# Altium schematic sheet Sheet2.SchDoc
size 594 x 420 mm; SheetNumber: 1; SheetTotal: 1
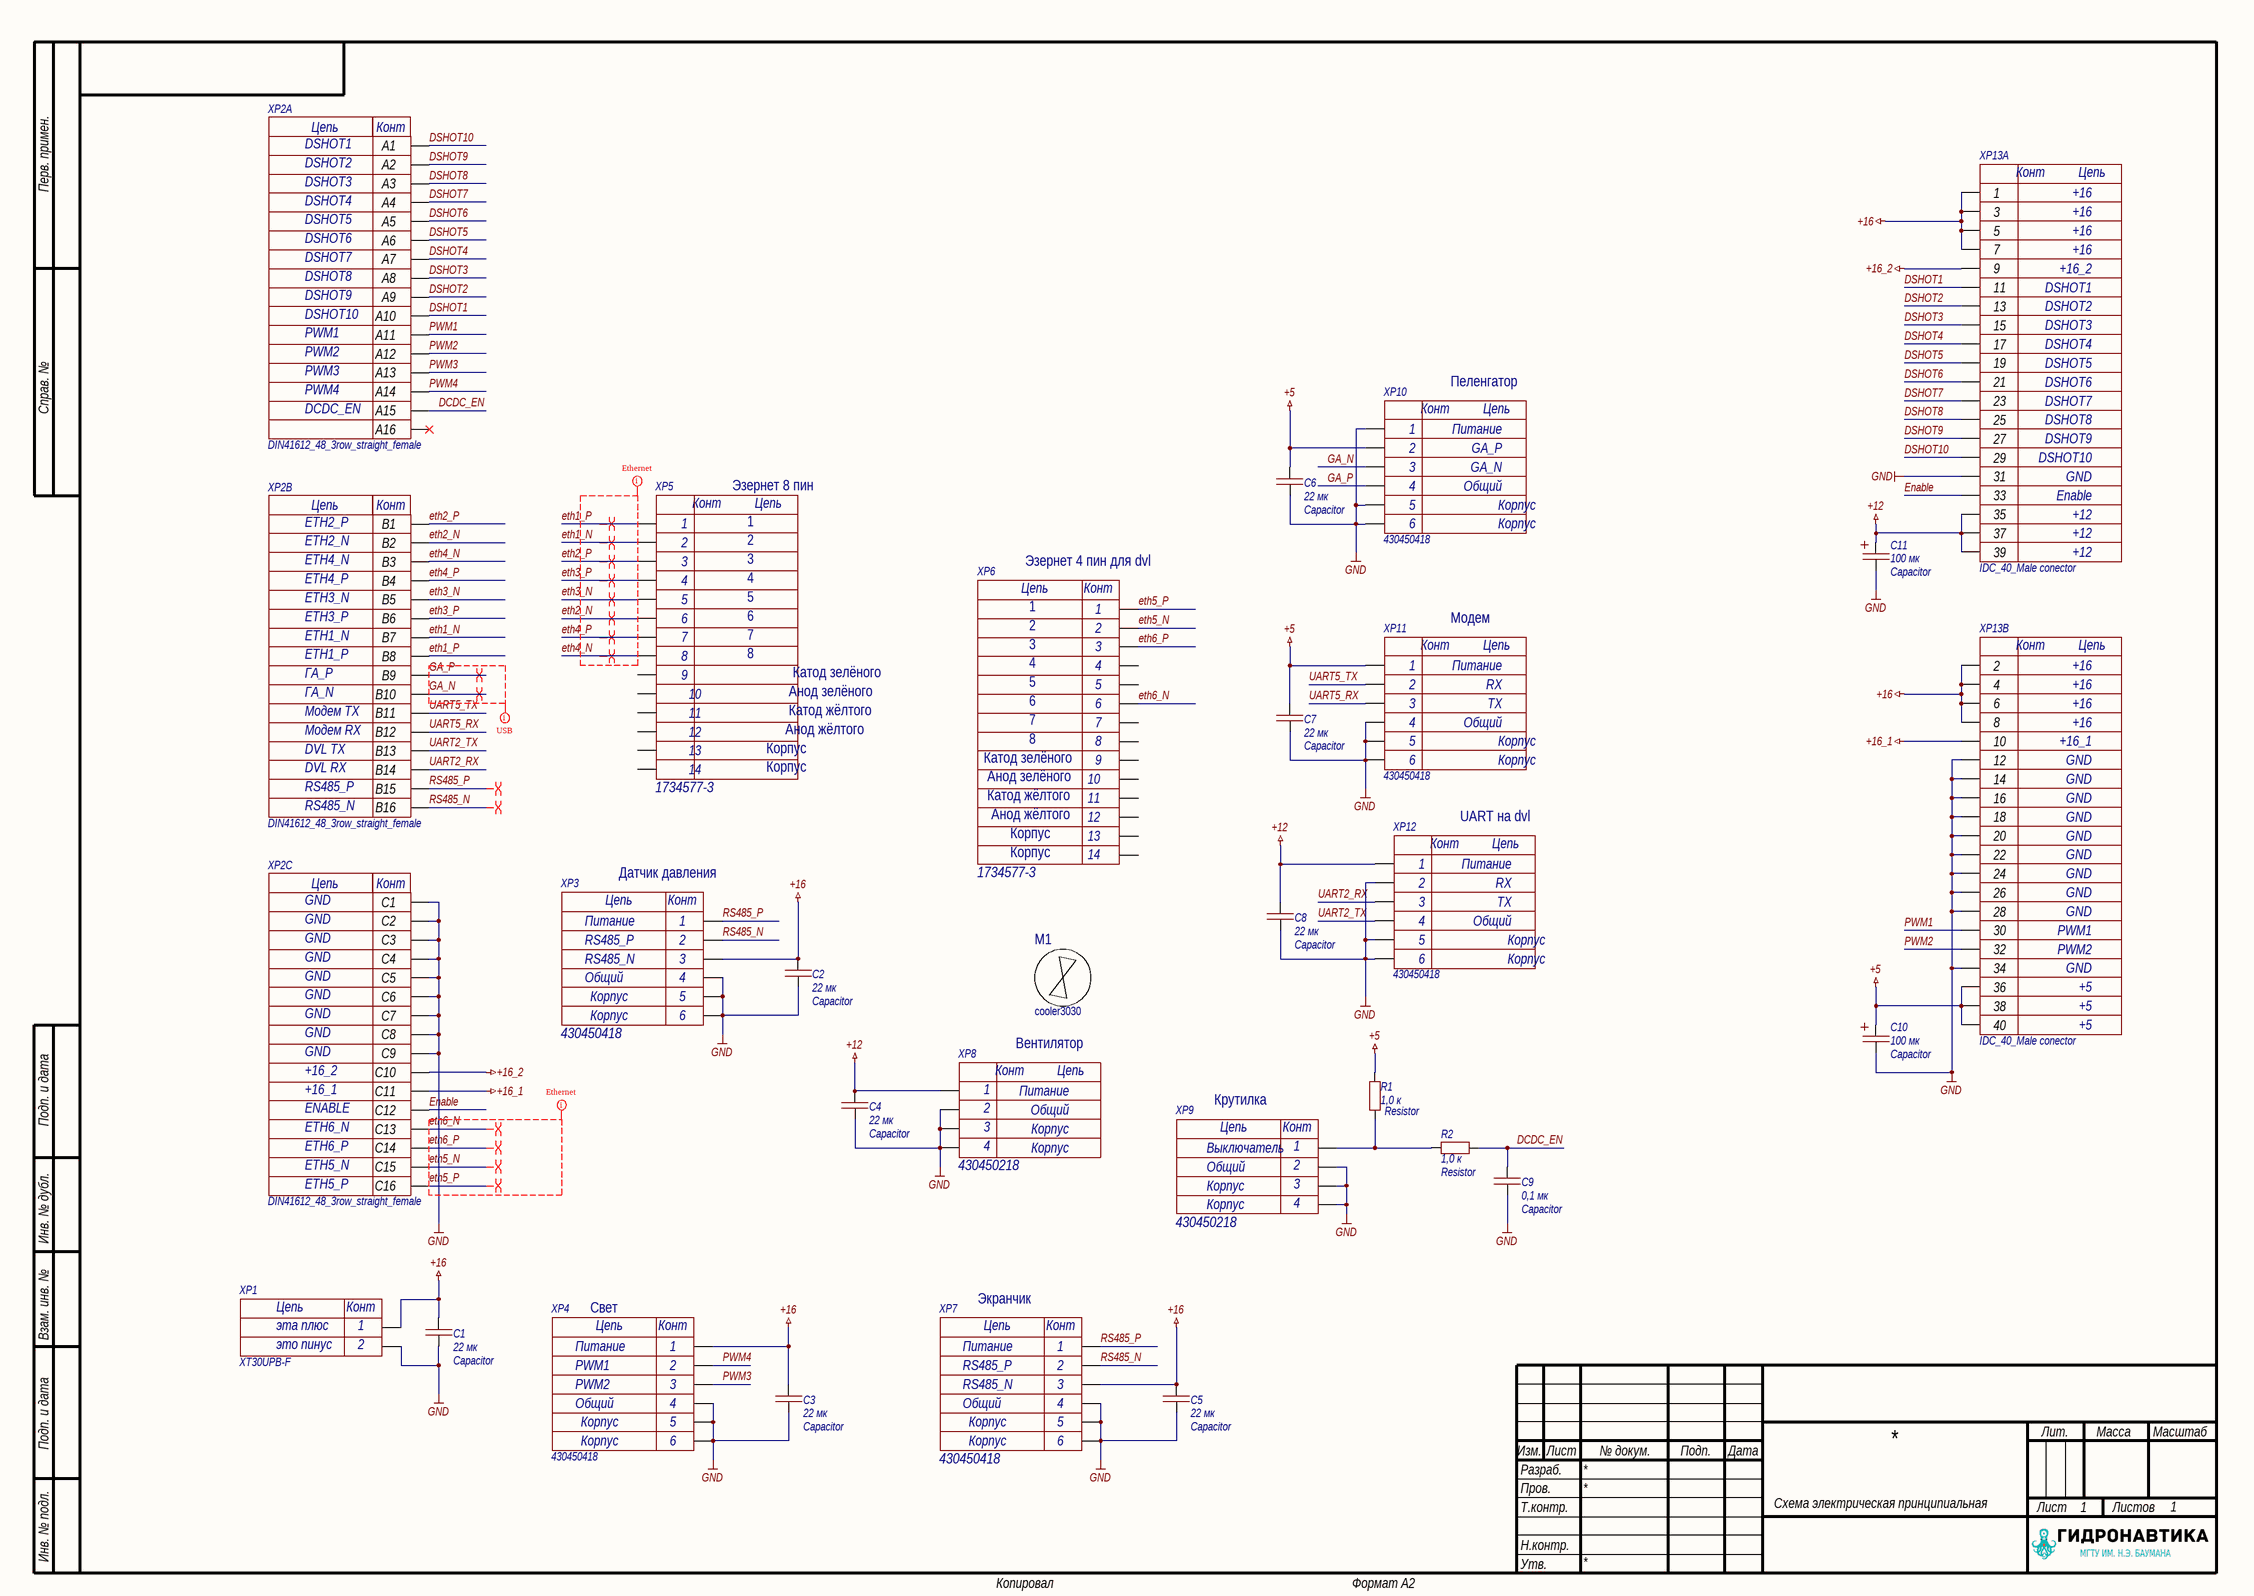
[diagram p0: Sheet2.SchDoc]

## Parts
C1  Capacitor  value 22 мк  [1210C]
C2  Capacitor  value 22 мк  [1210C]
C3  Capacitor  value 22 мк  [1210C]
C4  Capacitor  value 22 мк  [1210C]
C5  Capacitor  value 22 мк  [1210C]
C6  Capacitor  value 22 мк  [1210C]
C7  Capacitor  value 22 мк  [1210C]
C8  Capacitor  value 22 мк  [1210C]
C9  Capacitor  value 0,1 мк  [0603C]
C10  Capacitor  value 100 мк  [ECAP_SMD_6,6x6,6]
C11  Capacitor  value 100 мк  [ECAP_SMD_6,6x6,6]
M1  cooler3030  [cooler3030]
R1  Resistor  value 1,0 к  [0603R]
R2  Resistor  value 1,0 к  [0603R]
XP1  XT30UPB-F  Value2: это пинус  Value1: эта плюс  [XT30UPB-F]
XP2  DIN41612_48_3row_straight_female  Parameter 14: DCDC_EN  Parameter 15: PWM4  Parameter 12: DSHOT7  Parameter 13: DSHOT5  Parameter 11: DSHOT6  Parameter 10: DSHOT4  Parameter 9: DSHOT3  Parameter 8: DSHOT2  Parameter 5: DSHOT1  Parameter 6: PWM2  Parameter 7: PWM3  Parameter 4: DSHOT10  Parameter 3: DSHOT9  Parameter 2: DSHOT8  Parameter 1: PWM1  [DIN41612_48_3row_straight_female]  (parts A,B,C of 3)
XP3  430450418  Value1: Питание  Value2: RS485_P  Value3: RS485_N  Value4: Общий  [MOLEX_430450418]
XP4  430450418  Value1: Питание  Value2: PWM1  Value3: PWM2  Value4: Общий  [MOLEX_430450418]
XP5  1734577-3  [1-1734577-3-rj45-8p8c]
XP6  1734577-3  [1-1734577-3-rj45-8p8c]
XP7  430450418  Value1: Питание  Value2: RS485_P  Value3: RS485_N  Value4: Общий  [MOLEX_430450418]
XP8  430450218  Value3: Корпус  Value2: Общий  Value1: Питание  [Molex_430450218]
XP9  430450218  Value3: Корпус  Value2: Общий  Value1: Выключатель  [Molex_430450218]
XP10  430450418  Value1: Питание  Value2: GA_P  Value3: GA_N  Value4: Общий  [MOLEX_430450418]
XP11  430450418  Value1: Питание  Value2: RX  Value3: TX  Value4: Общий  [MOLEX_430450418]
XP12  430450418  Value1: Питание  Value2: RX  Value3: TX  Value4: Общий  [MOLEX_430450418]
XP13  IDC_40_Male conector  Value17: Enable  Value20: +12  Value16: GND  Value15: DSHOT10  Value14: DSHOT9  Value13: DSHOT8  Value12: DSHOT7  Value11: DSHOT6  Value10: DSHOT5  Value9: DSHOT4  Value8: DSHOT3  Value7: DSHOT2  Value6: DSHOT1  Value5: +16_2  Value4: +16  [IDC_40_Male conector]  (parts A,B of 2)

## Nets
+5: C6.2 C7.2 C10.1 R1.1 XP10.2 XP11.1 XP13.36 XP13.38 XP13.40
+12: C4.2 C8.2 C11.1 XP8.1 XP12.1 XP13.35 XP13.37 XP13.39
+16: C1.2 C2.2 C3.2 C5.2 XP1.P XP3.3 XP4.1 XP7.3 XP13.1 XP13.2 XP13.3 XP13.4 XP13.5 XP13.6 XP13.7 XP13.8
+16_1: XP2.C11 XP13.10
+16_2: XP2.C10 XP13.9
GND: C1.1 C2.1 C3.1 C4.1 C5.1 C6.1 C7.1 C8.1 C9.1 C10.2 C11.2 XP1.N XP2.C1 XP2.C2 XP2.C3 XP2.C4 XP2.C5 XP2.C6 XP2.C7 XP2.C8 XP2.C9 XP3.0 XP3.4 XP4.0 XP4.4 XP7.0 XP7.4 XP8.0 XP8.2 XP9.0 XP9.2 XP10.0 XP10.1 XP11.0 XP11.4 XP12.0 XP12.2 XP13.12 XP13.14 XP13.16 XP13.18 XP13.20 XP13.22 XP13.24 XP13.26 XP13.28 XP13.31 XP13.34
DCDC_EN: C9.2 R2.1 XP2.A15
DSHOT1: XP2.A10 XP13.11
DSHOT2: XP2.A9 XP13.13
DSHOT3: XP2.A8 XP13.15
DSHOT4: XP2.A7 XP13.17
DSHOT5: XP2.A6 XP13.19
DSHOT6: XP2.A5 XP13.21
DSHOT7: XP2.A4 XP13.23
DSHOT8: XP2.A3 XP13.25
DSHOT9: XP2.A2 XP13.27
DSHOT10: XP2.A1 XP13.29
Enable: XP2.C12 XP13.33
eth1_N: XP2.B7 XP5.2
eth1_P: XP2.B8 XP5.1
eth2_N: XP2.B2 XP5.6
eth2_P: XP2.B1 XP5.3
eth3_N: XP2.B5 XP5.5
eth3_P: XP2.B6 XP5.4
eth4_N: XP2.B3 XP5.8
eth4_P: XP2.B4 XP5.7
eth5_N: XP2.C15 XP6.2
eth5_P: XP2.C16 XP6.1
eth6_N: XP2.C13 XP6.6
eth6_P: XP2.C14 XP6.3
GA_N: XP2.B10 XP10.3
GA_P: XP2.B9 XP10.4
PWM1: XP2.A11 XP13.30
PWM2: XP2.A12 XP13.32
PWM3: XP2.A13 XP4.3
PWM4: XP2.A14 XP4.2
RS485_N: XP2.B16 XP3.2 XP7.2
RS485_P: XP2.B15 XP3.1 XP7.1
UART2_RX: XP2.B14 XP12.3
UART2_TX: XP2.B13 XP12.4
UART5_RX: XP2.B12 XP11.3
UART5_TX: XP2.B11 XP11.2
NetR1_2: R1.2 R2.2 XP9.1

Not connected (* = marked no-connect by the designer): XP2 A16*; XP5 9 10 11 12 MH1 MH2; XP6 4 5 7 8 9 10 11 12 MH1 MH2

## Layout directives
differential pair: eth1_N, eth1_P, eth2_N, eth2_P, eth3_N, eth3_P, eth4_N, eth4_P, eth5_N, eth5_P, eth6_N, eth6_P, GA_N, GA_P, RS485_N, RS485_P
net class Ethernet: (no net found under the mark), eth5_N, eth5_P, eth6_N, eth6_P
net class USB: GA_N, GA_P

## Notes on the sheet
- Пеленгатор
- Эзернет 8 пин
- (near XP6) Эзернет 4 пин для dvl
- Модем
- UART на dvl
- (near XP3) Датчик давления
- Вентилятор
- Крутилка
- Свет
- Экранчик
- Перв. примен.
- Справ. №
- Подп. и дата
- Инв. № дубл.
- Взам. инв. №
- Разраб.
- Изм.
- Лист
- № докум.
- Подп.
- Дата
- Лит.
- Масса
- Масштаб
- Пров.
- Т.контр.
- Схема электрическая принципиальная
- Листов
- Инв. № подл.
- Утв.
- Н.контр.
- Копировал
- Формат А2
- (in symbol 1-1734577-3-rj45-8p8c) Конт; Цепь; Катод зелёного; Анод зелёного; Катод жёлтого; Анод жёлтого; Корпус; 13; 14
- (in symbol DIN41612_48_3row_straight_female, part A) Цепь; Конт
- (in symbol DIN41612_48_3row_straight_female, part B) Цепь; Конт
- (in symbol DIN41612_48_3row_straight_female, part C) Цепь; Конт
- (in symbol IDC_40_Male conector, part A) Конт; Цепь
- (in symbol IDC_40_Male conector, part B) Конт; Цепь
- (in symbol Molex_430450218) Конт; Цепь; 3; 4
- (in symbol Molex_430450418) Цепь; Конт; Корпус; 5; 6
- (in symbol XT30UPB-F) Цепь; Конт; 1; 2

## Library data of the parts
C1-C8 = Capacitor_22u_10_25V_X7R_1210C: Конденсатор 1210C ёмкостью 22 мк 10%, 25 В, X7R; Voltage (V): 25; Capacity (nF): 22000; Part Number: Capacitor_22u_10_25V_X7R_1210C; Tolerance: 10%; Dielectric: X7R
C9 = Capacitor_0,1u_10_50V_X7R_0603C: Конденсатор 0603C ёмкостью 0,1 мк 10%, 50 В, X7R; Voltage (V): 50; Capacity (nF): 100; Part Number: Capacitor_0,1u_10_50V_X7R_0603C; Tolerance: 10%; Dielectric: X7R
C10 C11 = JCK1V101: Конденсатор алюминиевый электролитический 100мкФ 35В 20% SMD 6,6x6,6 мм; Tolerance: 20; Voltage (V): 35; Type: SMD Aluminum; Capacity (uF): 100; Part Number: JCK1V101
M1 = cooler3030: вентилятор 30*30 с дыркой на плате; Part Number: cooler3030
R1 R2 = Resistor_1.0k_1_0603: Резистор номиналом 1,0 кОм 1%; Power: *; Part Number: Resistor_1.0k_1_0603; Tolerance: 1%
XP1 = XT30UPB-F: 30 А (15 продолжительно), прямая мать; System: Connector; Part Number: XT30UPB-F
XP2 = DIN41612_48_3row_straight_female: DIN41612R (DS1120-48F0V13), Разъем (розетка) тип B 48pin (3х16), шаг 2.54мм трехрядный прямой (ряд АBC); System: Connector; Part Number: DIN41612_48_3row_straight_female; Datasheet: https://cdn.promelec.ru/upload/datasheet/3/1/DS1120.pdf
XP3 XP4 XP7 XP10-XP12 = Molex_430450418: Разъем типа провод-плата, 3 мм, 4 контакт(-ов), Штыревой Разъем, для поверностного монтажа; System: Connector; Part Number: Molex_430450418
XP5 XP6 = 1-1734577-3-rj45-8p8c: Модульный разъем, Cat3, RJ45, Гнездо, 8 контакт(-ов), 8 вывод(-ов), 1 порт(-ов); System: Connector; Part Number: 1-1734577-3-rj45-8p8c
XP8 XP9 = Molex_430450218: Разъем типа провод-плата, 3 мм, 2 контакт(-ов), Штыревой Разъем, Серия Micro-Fit для поверхностного монтажа; System: Connector; Value4: Корпус; Part Number: Molex_430450218
XP13 = IDC_40_Male conector: IDC 40-пиновый разъём прямая вилка; System: Connector; Value19: +12; Value18: +12; Value3: +16; Value2: +16; Value1: +16; Part Number: IDC_40_Male conector